# EAGLE design 307_ble_NRF51 (EAGLE 9.6.2)
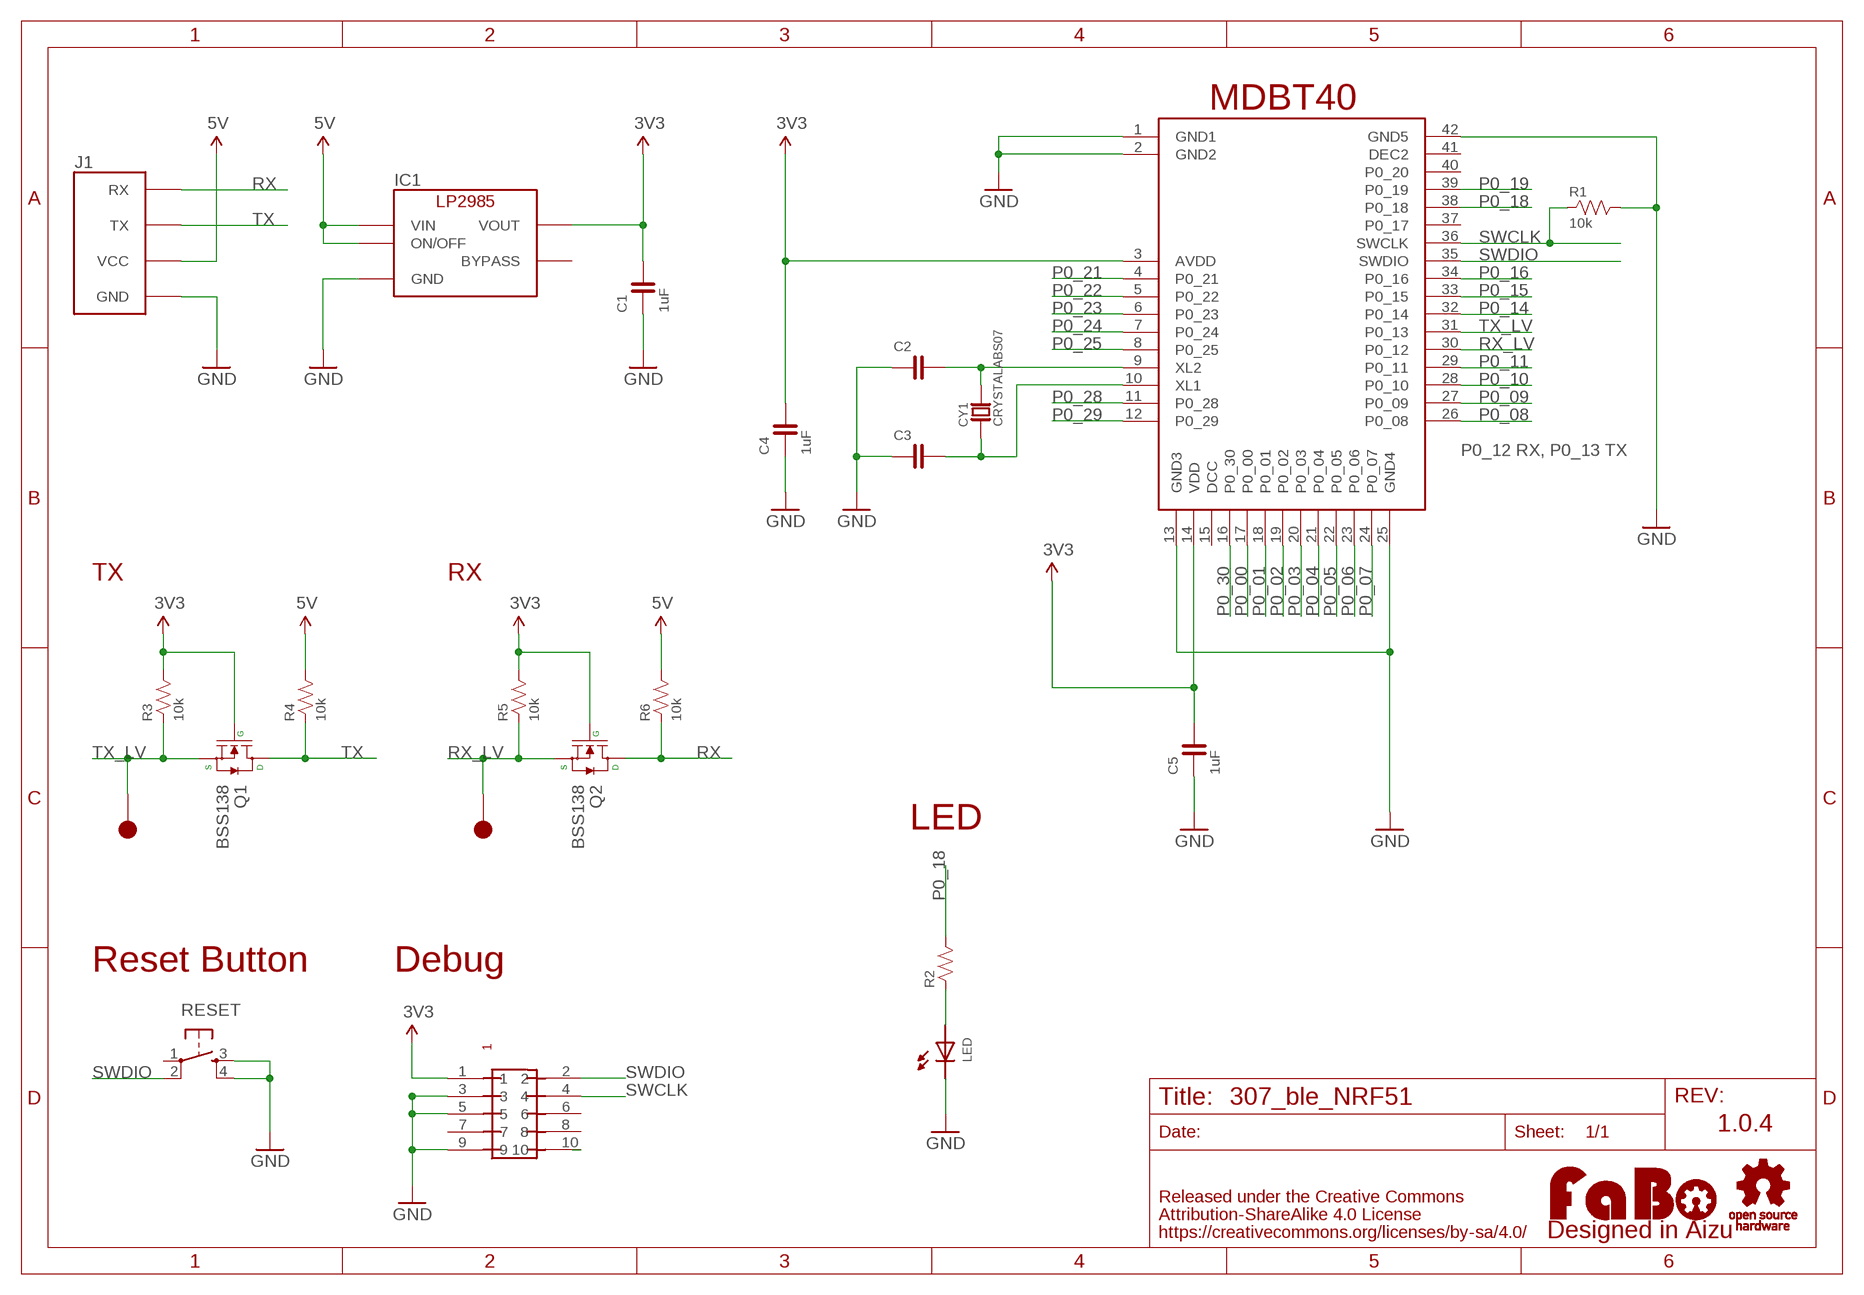
[diagram p0: schematic, sheet 1]

## Parts
C1  1uF  CAPACITOR-0603_NARROW  [0603-NARROW]
C2  CAPACITOR-0603_NARROW  [0603-NARROW]
C3  CAPACITOR-0603_NARROW  [0603-NARROW]
C4  1uF  CAPACITOR-0603_NARROW  [0603-NARROW]
C5  1uF  CAPACITOR-0603_NARROW  [0603-NARROW]
CY1  CRYSTALABS07  [ABRACOM-ABS07-32.768KHZ]
IC1  LP2985-33DBV  [SOT-23-5]
J1  FABO_BRICK_SERIAL  [FABO_BRICK_SERIAL]
LED  LED-0603  [0603]
LOGO1  LOGO_FABO-M_BOTTOM  [LOGO_FABO_M_BOTTOM]
Q1  BSS138  MOSFET-N-BSS138  [SOT23-3]
Q2  BSS138  MOSFET-N-BSS138  [SOT23-3]
R1  10k  RESISTOR-0603-NARROW  [0603-NARROW]
R2  RESISTOR-0603-NARROW  [0603-NARROW]
R3  10k  RESISTOR-0603-NARROW  [0603-NARROW]
R4  10k  RESISTOR-0603-NARROW  [0603-NARROW]
R5  10k  RESISTOR-0603-NARROW  [0603-NARROW]
R6  10k  RESISTOR-0603-NARROW  [0603-NARROW]
RESET  TACT-SWITCH-SMD_KMR2  [KMR2]
TP10  TP-15  [TP-15]
TP11  TP-15  [TP-15]
U$2  LOGO_OSHW-M_BOTTOM  [LOGO_OSHW_M_BOTTOM]
U$7  RAYTAC-MDBT40  [RAYTAC-MDBT40]
U$8  PIN-HEADER-SMT(1.27MM)2X5  [PIN-HEADER-SMT(1.27MM)2X5]

## Nets
3V3: C1.2 C4.2 C5.2 IC1.5(VOUT) Q1.1(G) Q2.1(G) R3.2 R5.2 U$7.3(AVDD) U$7.14(VDD) U$8.1
5V: IC1.1(VIN) IC1.3(ON/OFF) J1.VCC R4.2 R6.2
GND: C1.1 C2.1 C3.1 C4.1 C5.1 IC1.2(GND) J1.GND LED.CATHODE R1.2 RESET.3 RESET.4 U$7.1(GND1) U$7.2(GND2) U$7.13(GND3) U$7.25(GND4) U$7.42(GND5) U$8.3 U$8.5 U$8.9
N$3: LED.ANODE R2.1
N$7: C2.2 CY1.P$2 U$7.9(XL2)
N$8: C3.2 CY1.P$1 U$7.10(XL1)
P0_00: U$7.17(P0_00)
P0_01: U$7.18(P0_01)
P0_02: U$7.19(P0_02)
P0_03: U$7.20(P0_03)
P0_04: U$7.21(P0_04)
P0_05: U$7.22(P0_05)
P0_06: U$7.23(P0_06)
P0_07: U$7.24(P0_07)
P0_08: U$7.26(P0_08)
P0_09: U$7.27(P0_09)
P0_10: U$7.28(P0_10)
P0_11: U$7.29(P0_11)
P0_14: U$7.32(P0_14)
P0_15: U$7.33(P0_15)
P0_16: U$7.34(P0_16)
P0_18: R2.2 U$7.38(P0_18)
P0_19: U$7.39(P0_19)
P0_21: U$7.4(P0_21)
P0_22: U$7.5(P0_22)
P0_23: U$7.6(P0_23)
P0_24: U$7.7(P0_24)
P0_25: U$7.8(P0_25)
P0_28: U$7.11(P0_28)
P0_29: U$7.12(P0_29)
P0_30: U$7.16(P0_30)
RESET: U$8.10
RX: J1.RX Q2.3(D) R6.1
RX_LV: Q2.2(S) R5.1 TP10.1 U$7.30(P0_12)
SWCLK: R1.1 U$7.36(SWCLK) U$8.4
SWDIO: RESET.2 U$7.35(SWDIO) U$8.2
TX: J1.TX Q1.3(D) R4.1
TX_LV: Q1.2(S) R3.1 TP11.1 U$7.31(P0_13)
Unconnected: IC1.4(BYPASS) RESET.1 U$7.15(DCC) U$7.37(P0_17) U$7.40(P0_20) U$7.41(DEC2) U$8.6 U$8.7 U$8.8

## Notes on the sheet
- MDBT40
- P0_12 RX, P0_13 TX
- TX | RX
- LED
- Reset Button | Debug
- 1.0.4

## Library data of the parts
C1-C5 = FaBo-Capacitor:CAPACITOR: CAPACITOR
CY1 = FaBo-Crystal:CRYSTAL
IC1 = FaBo-Supply:LP2985: LP2985
J1 = FaBo-Template:FABO_BRICK_SERIAL: FaBo Brick Serial
LED = FaBo-LED:LED
LOGO1 = component:LOGO_FABO
Q1 Q2 = FaBo-etc:MOSFET-N
R1-R6 = FaBo-Resistors:RESISTOR: RESISTOR
RESET = FaBo-Switch:TACT-SWITCH
TP10 TP11 = FaBo-Supply:TP
U$2 = FaBo-etc:LOGO_OSHW
U$7 = FaBo-BT:RAYTAC-MDBT40
U$8 = GClue:PIN-HEADER-SMT(1.27MM)2X5: PIN-HEADER-SMT (1.27MM) 2x5

## Board
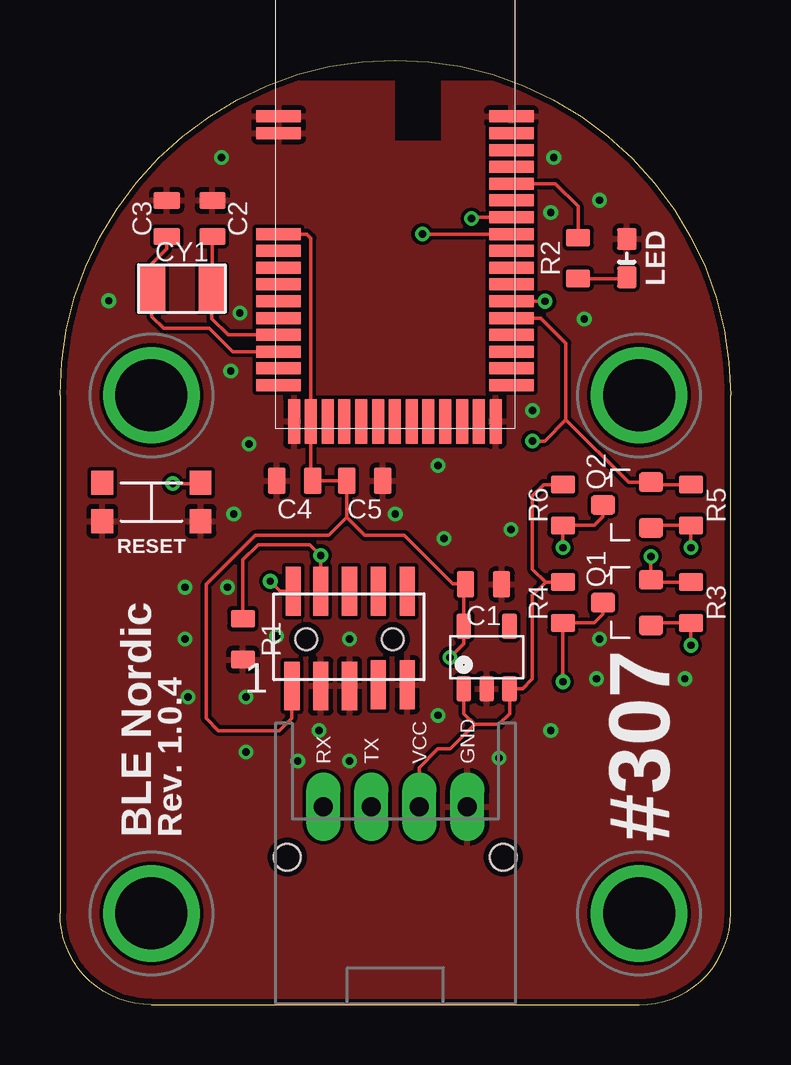
[diagram p1: board, top side]
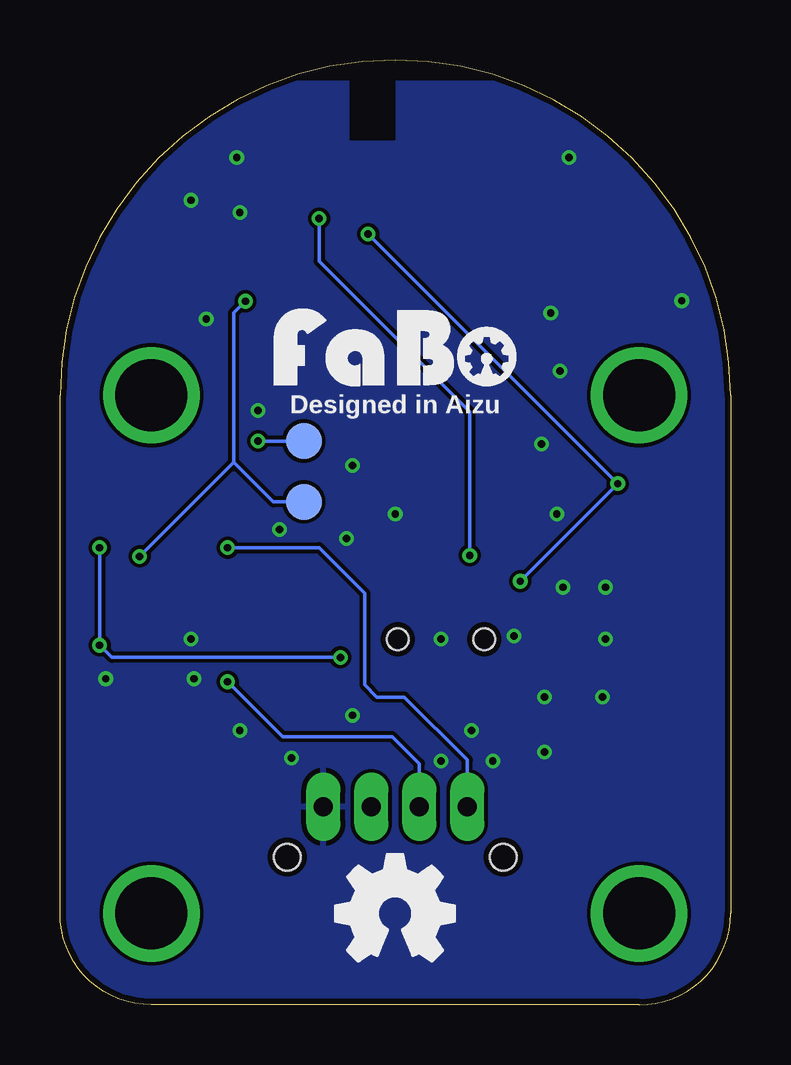
[diagram p2: board, bottom side, seen from below]

Size 27.94 x 39.37 mm. Coordinates in mm from the lower left corner, seen from the top.
Copper layers (1*16): Top 0.035mm / dielectric 1.6mm / Bottom 0.035mm
Design rules "PCBway": minimum track width 6mil, minimum drill 12mil, track to track 6mil, track to pad 6mil, pad to pad 6mil, via to via 6mil, smd to smd 6mil, copper to edge 10mil, drill to drill 10mil, minimum pad ring 10mil, minimum via ring 6mil, stop-mask expansion 2mil, vias tented up to drill 100mil, thermal gap 8mil

### Footprints (pad centres in the part's own frame; a part is rotated, then mirrored left to right if it is on the bottom)
0603-NARROW = smd 0.71 x 1.09: 1 -0.75,0; 2 0.75,0
ABRACOM-ABS07-32.768KHZ = smd 1.1 x 1.9: P$1 -1.25,0; P$2 1.25,0
SOT-23-5 = smd 0.6 x 1.05: 1 -0.95,-1.3; 2 0,-1.3; 3 0.95,-1.3; 4 0.95,1.3; 5 -0.95,1.3
FABO_BRICK_SERIAL = drill 0.8 pad 1.422 long: GND 3,-10.795; RX -3,-10.795; TX -1,-10.795; VCC 1,-10.795 | drill 3 pad 3.81: P$1 -10.16,6.35; P$2 10.16,6.35; P$3 -10.16,-15.24; P$4 10.16,-15.24 | hole 1.1: -4.5,-12.895; 4.5,-12.895
0603 = smd 0.9 x 0.8: ANODE -0.8,0; CATHODE 0.8,0
SOT23-3 = smd 0.8 x 1: 1 -0.95,-1; 2 0.95,-1; 3 0,1
0603-NARROW' = smd 0.75 x 1: 1 -0.85,0; 2 0.85,0
KMR2 = smd 0.9 x 1: 1 -2.05,0.8; 2 2.05,0.8; 3 2.05,-0.8; 4 -2.05,-0.8
TP-15 = smd 1.5 x 1.5: 1 0,0
RAYTAC-MDBT40 = smd 1.85 x 0.5: 1 -4.86,4; 2 -4.86,3.3; 3 -4.86,-0.9; 4 -4.86,-1.6; 5 -4.86,-2.3; 6 -4.86,-3; 7 -4.86,-3.7; 8 -4.86,-4.4; 9 -4.86,-5.1; 10 -4.86,-5.8; 11 -4.86,-6.5; 12 -4.86,-7.2; 26 4.84,-7.2; 27 4.84,-6.5; 28 4.84,-5.8; 29 4.84,-5.1; 30 4.84,-4.4; 31 4.84,-3.7; 32 4.84,-3; 33 4.84,-2.3; 34 4.84,-1.6; 35 4.84,-0.9; 36 4.84,-0.2; 37 4.84,0.5; 38 4.84,1.2; 39 4.84,1.9; 40 4.84,2.6; 41 4.84,3.3; 42 4.84,4 | smd 0.5 x 1.85: 13 -4.22,-8.71; 14 -3.52,-8.71; 15 -2.82,-8.71; 16 -2.12,-8.71; 17 -1.42,-8.71; 18 -0.72,-8.71; 19 -0.02,-8.71; 20 0.68,-8.71; 21 1.38,-8.71; 22 2.08,-8.71; 23 2.78,-8.71; 24 3.48,-8.71; 25 4.18,-8.71
PIN-HEADER-SMT(1.27MM)2X5 = smd 0.635 x 2.032: 1 -2.4,-1.95; 2 -2.35,2; 3 -1.2,-1.95; 4 -1.2,2; 5 0,-1.95; 6 0,2; 7 1.2,-1.9; 8 1.2,2; 9 2.4,-1.9; 10 2.4,2 | hole 0.9: 1.8,0; -1.8,0

### Placement (x,y rotation side)
C1  17.65,17.53 180 top
C2  6.35,32.77 270 top
C3  4.45,32.77 270 top
C4  9.78,21.84 0 top
C5  12.7,21.84 180 top
CY1  5.08,29.84 0 top
IC1  17.78,14.48 0 top
J1  13.97,19.05 0 top
LED  23.62,31.11 90 top
LOGO1  13.97,25.4 0 top
Q1  23.62,16.76 90 top
Q2  23.62,20.83 90 top
R1  10k  [0603-NARROW']  7.62,15.24 270 top
R2  [0603-NARROW']  21.59,31.11 90 top
R3  10k  [0603-NARROW']  26.29,16.76 270 top
R4  10k  [0603-NARROW']  20.95,16.76 90 top
R5  10k  [0603-NARROW']  26.29,20.83 270 top
R6  10k  [0603-NARROW']  20.95,20.83 90 top
RESET  3.81,20.95 0 top
TP10  17.78,23.5 0 bottom
TP11  17.78,20.95 0 bottom
U$2  13.97,3.81 0 top
U$7  13.97,33.02 0 top
U$8  12.06,15.24 0 top

### Tracks (layer width: path | path; a pad name or v marks a point on that pad's centre or on a via)
3V3  (via drill 0.3)
  Top 0.152: U$8.1 9.66,11.95 9.14,11.43 6.6,11.43 6.1,11.94 6.1,17.53 8.13,19.56 11.2,19.56 11.95,20.31 | Q1.1 24.72,15.91 R3.2 v26.29,14.99 | v16.26,14.48 16.83,15.05 IC1.5 16.83,17.45 C1.2 16.37,17.54 14.35,19.56 12.7,19.56 11.95,20.31 | v26.29,19.05 R5.2 24.72,19.98 Q2.1 | 11.95,20.31 C5.2 C4.2 10.45,22.05 U$7.14 10.45,31.95 10.28,32.12 U$7.3
  Bottom 0.152: v16.26,14.48 25.78,14.48 v26.29,14.99 v26.29,19.05
5V
  Top 0.152: IC1.1 16.83,12.13 17.27,11.68 | 17.27,11.68 18.29,11.68 18.73,12.13 IC1.3 19.27,13.18 19.68,13.59 19.68,17.07 20.23,17.61 | J1.VCC 14.97,9.89 15.75,10.67 16.26,10.67 17.27,11.68 | R4.2 20.23,17.61 | 20.23,17.61 19.68,18.16 19.68,21.21 20.15,21.68 R6.2
GND  (via drill 0.3)
  other vias: 7.75,12.83 9.91,10.16 10.79,11.43 7.75,10.54 5.33,12.83 6.99,17.4 5.21,17.4 5.21,15.24 9.02,15.37 12.06,15.24 7.87,23.37 7.11,26.42 7.24,20.45 7.49,28.83 6.73,35.31 2.03,29.34 16,19.43 15.75,22.48 20.45,11.43 15.75,12.06 22.35,13.59 12.06,10.16 18.29,10.29 22.48,15.24 26.04,13.59 18.8,19.81 21.84,28.57 19.68,24.77 22.48,33.53 20.45,33.02 20.57,35.31 13.97,20.45
  pour Bottom: 0,0 27.94,0 27.94,39.37 0,39.37
  pour Top: 0,0 27.94,0 27.94,39.37 0,39.37
N$3
  Top 0.152: R2.1 23.57,30.27 LED.ANODE
N$7
  Top 0.152: U$7.9 7,27.92 6.33,28.59 CY1.P$2 6.35,29.86 C2.2
N$8
  Top 0.152: U$7.10 7.2,27.22 6.22,28.19 4.32,28.19 3.83,28.68 CY1.P$1 3.83,30.88 4.45,31.5 C3.2
P0_18
  Top 0.152: U$7.38 20.64,34.22 21.59,33.27 R2.2
RX  (via drill 0.3)
  Top 0.152: v20.95,19.05 R6.1 22.26,19.98 22.62,20.34 Q2.3
  Bottom 0.152: J1.RX 10.97,10.21 13.59,12.83 14.73,12.83 15.24,13.34 15.24,17.14 17.14,19.05 v20.95,19.05
RX_LV  (via drill 0.3)
  Top 0.152: 21.08,24.38 23.69,21.78 Q2.2 24.72,21.68 R5.1 | 21.08,24.38 21.08,27.56 20.02,28.62 U$7.30 | v19.68,23.5 20.19,23.5 21.08,24.38
  Bottom 0.152: TP10.1 v19.68,23.5
SWCLK  (via drill 0.3)
  Top 0.152: U$8.4 v10.87,18.73 10.41,19.18 8.26,19.18 7.62,18.54 R1.1 | U$7.36 17.2,32.82 v17.14,32.77
  Bottom 0.152: v17.14,32.77 17.14,30.99 10.87,24.71 v10.87,18.73
SWDIO  (via drill 0.3)
  Top 0.152: U$8.2 9.18,17.24 v8.76,17.65 | v4.7,21.72 5.82,21.72 | U$7.35 v15.1,32.12
  Top 0.203: 5.82,21.72 RESET.2
  Bottom 0.152: v8.76,17.65 v4.7,21.72 v15.1,32.12
TX  (via drill 0.3)
  Top 0.152: v20.95,13.46 R4.1 22.26,15.91 22.62,16.27 Q1.3
  Bottom 0.152: J1.TX 12.97,10.05 14.1,11.18 18.67,11.18 v20.95,13.46
TX_LV  (via drill 0.3)
  Top 0.152: v24.62,18.68 Q1.2 24.72,17.61 R3.1 | U$7.31 v20.21,29.32
  Bottom 0.152: v24.62,18.68 20.7,22.61 | 20.7,22.61 20.7,28.83 v20.21,29.32 | TP11.1 19.05,20.95 20.7,22.61

### Text on the board
tPlace: RESET | #307 | BLE Nordic | Rev. 1.0.4
bPlace: Designed in Aizu